# Altium schematic sheet Display.SchDoc
size A3
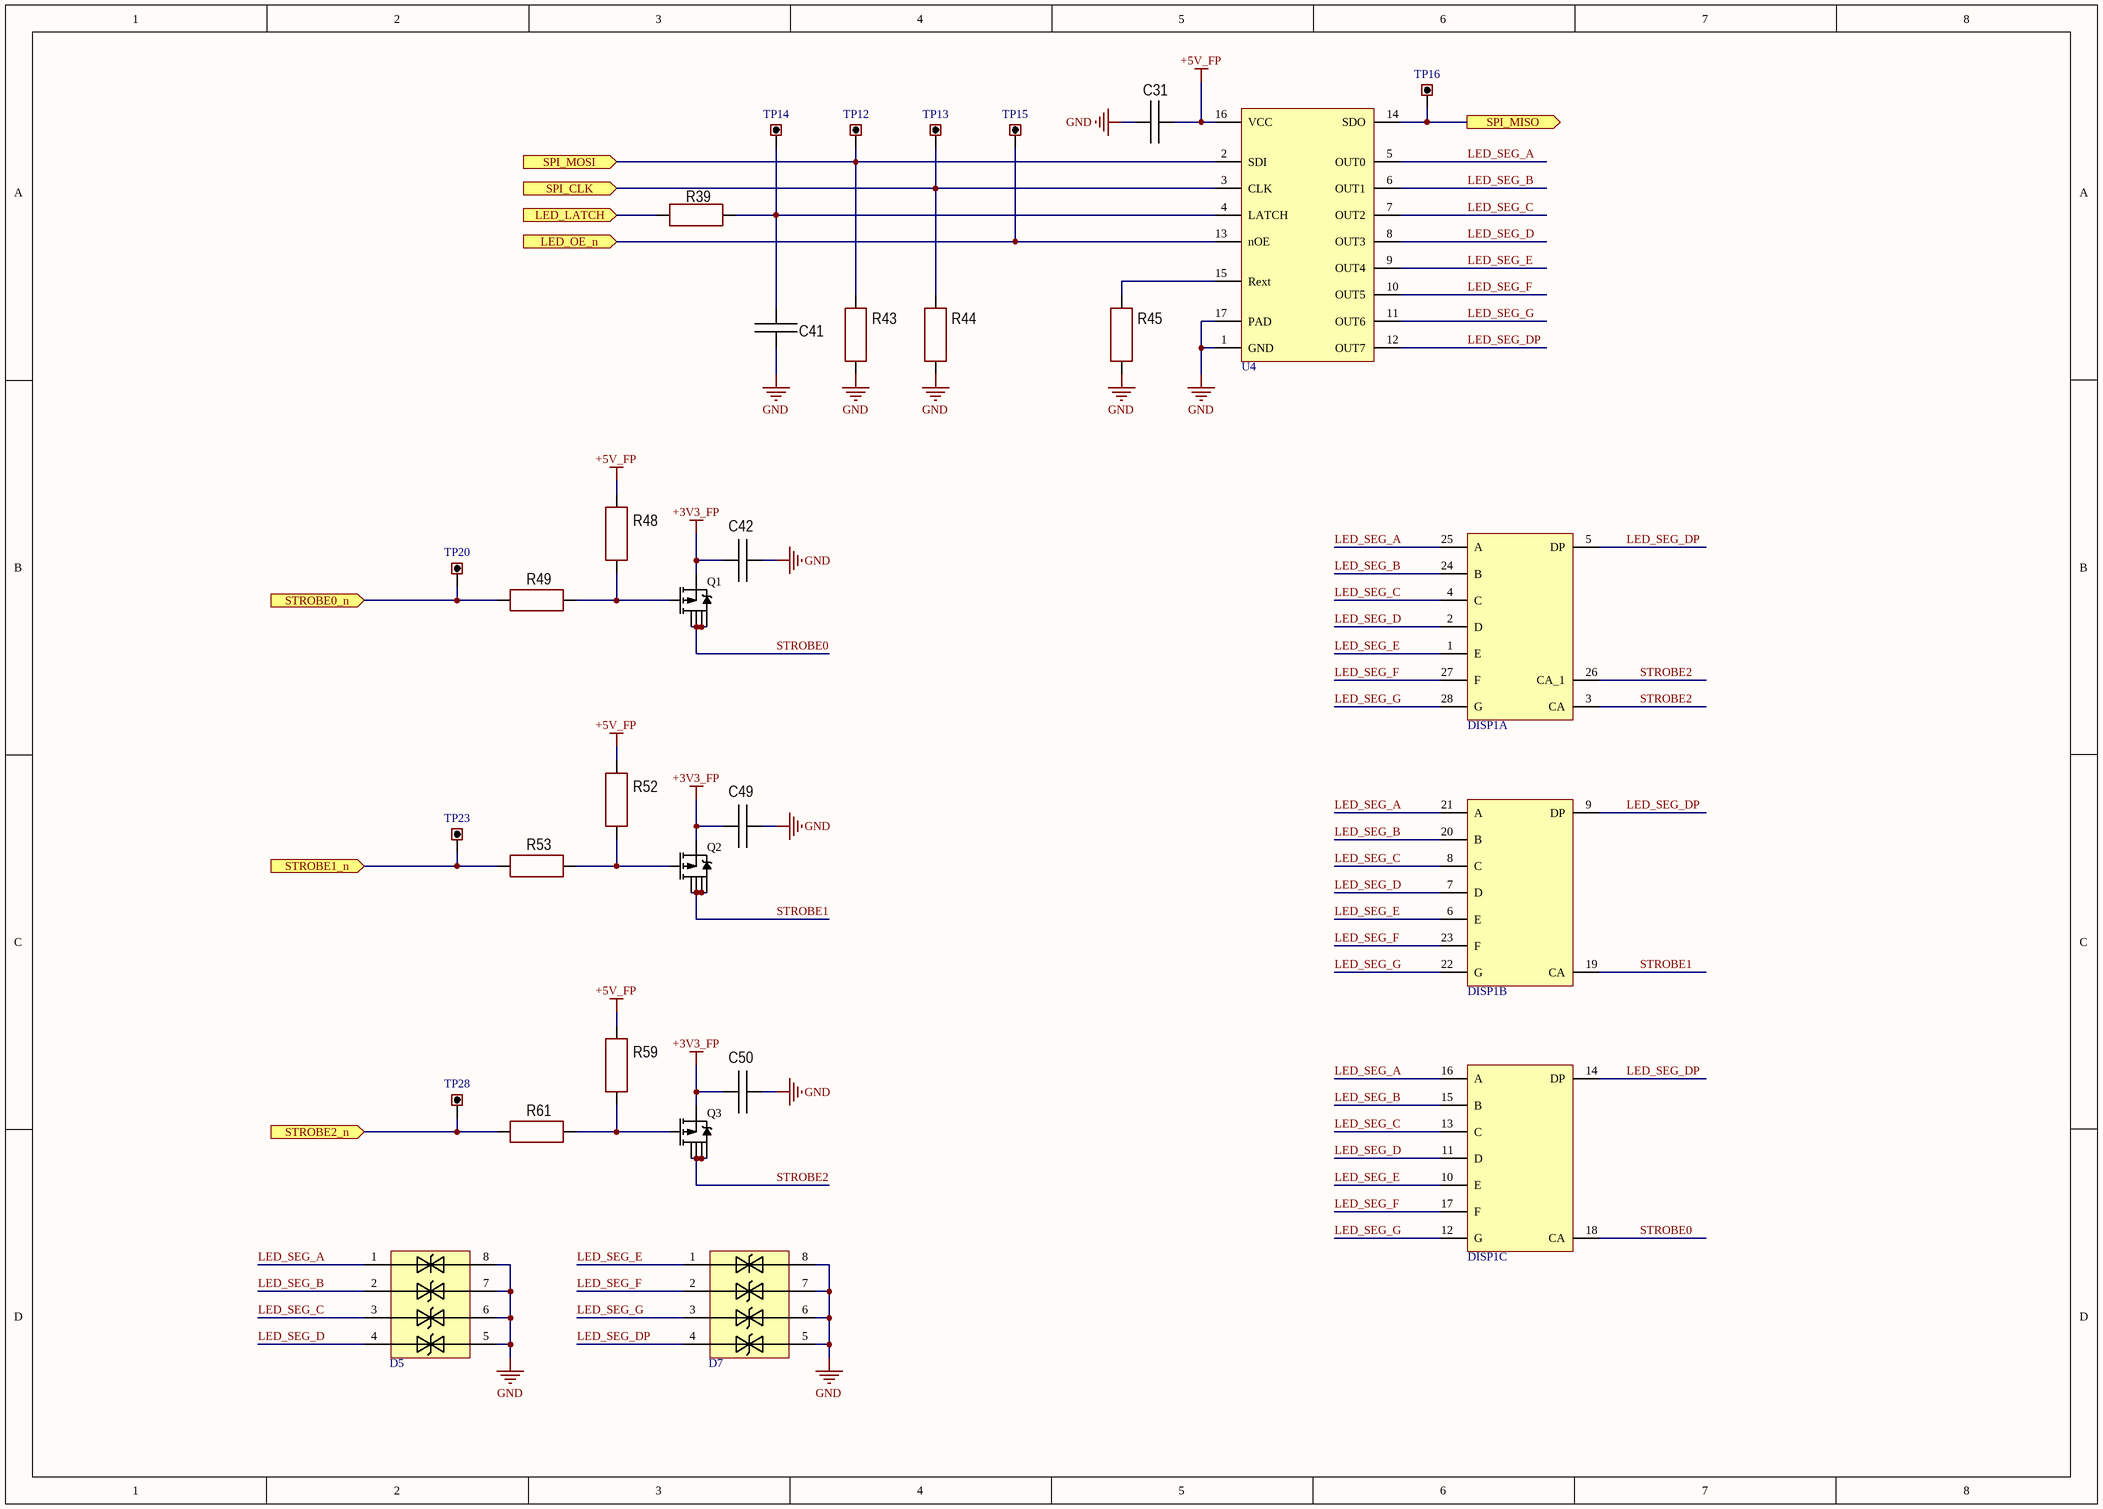
[diagram p0: Display.SchDoc]

## Parts
C31  (no value)  [CAP: 1206]
C41  (no value)  [CAP: 1206]
C42  (no value)  [CAP: 1206]
C49  (no value)  [CAP: 1206]
C50  (no value)  [CAP: 1206]
D5  (no value)  [8-SOIC]
D7  (no value)  [8-SOIC]
DISP1  (no value)  [BC56-11SRWA]  (parts A,B,C of 3)
Q1  (no value)  [SOT23-6]
Q2  (no value)  [SOT23-6]
Q3  (no value)  [SOT23-6]
R39  (no value)  [RES: 1206]
R43  (no value)  [RES: 1206]
R44  (no value)  [RES: 1206]
R45  (no value)  [RES: 1206]
R48  (no value)  [RES: 1206]
R49  (no value)  [RES: 1206]
R52  (no value)  [RES: 1206]
R53  (no value)  [RES: 1206]
R59  (no value)  [RES: 1206]
R61  (no value)  [RES: 1206]
TP12  Test_Point  [Test_Point]  (value not drawn)  (no BOM)
TP13  Test_Point  [Test_Point]  (value not drawn)  (no BOM)
TP14  Test_Point  [Test_Point]  (value not drawn)  (no BOM)
TP15  Test_Point  [Test_Point]  (value not drawn)  (no BOM)
TP16  Test_Point  [Test_Point]  (value not drawn)  (no BOM)
TP20  Test_Point  [Test_Point]  (value not drawn)  (no BOM)
TP23  Test_Point  [Test_Point]  (value not drawn)  (no BOM)
TP28  Test_Point  [Test_Point]  (value not drawn)  (no BOM)
U4  (no value)  [STP08DP05]

## Ports
LED_LATCH (in), LED_OE_n (in), SPI_CLK (in), SPI_MISO (out), SPI_MOSI (in), STROBE0_n (in), STROBE1_n (in), STROBE2_n (in)

## Nets
+3V3_FP: C42.1 C49.1 C50.1 Q1.4(S) Q2.4(S) Q3.4(S)
+5V_FP: C31.2 R48.2 R52.2 R59.2 U4.16(VCC)
GND: C31.1 C41.1 C42.2 C49.2 C50.2 D5.5 D5.6 D5.7 D5.8 D7.5 D7.6 D7.7 D7.8 R43.2 R44.2 R45.2 U4.1(GND) U4.17(PAD)
LED_LATCH: R39.1 ; port LED_LATCH
LED_OE_n: TP15.1 U4.13(nOE) ; port LED_OE_n
LED_SEG_A: D5.1 DISP1.16(A) DISP1.21(A) DISP1.25(A) U4.5(OUT0)
LED_SEG_B: D5.2 DISP1.15(B) DISP1.20(B) DISP1.24(B) U4.6(OUT1)
LED_SEG_C: D5.3 DISP1.4(C) DISP1.8(C) DISP1.13(C) U4.7(OUT2)
LED_SEG_D: D5.4 DISP1.2(D) DISP1.7(D) DISP1.11(D) U4.8(OUT3)
LED_SEG_DP: D7.4 DISP1.5(DP) DISP1.9(DP) DISP1.14(DP) U4.12(OUT7)
LED_SEG_E: D7.1 DISP1.1(E) DISP1.6(E) DISP1.10(E) U4.9(OUT4)
LED_SEG_F: D7.2 DISP1.17(F) DISP1.23(F) DISP1.27(F) U4.10(OUT5)
LED_SEG_G: D7.3 DISP1.12(G) DISP1.22(G) DISP1.28(G) U4.11(OUT6)
SPI_CLK: R44.1 TP13.1 U4.3(CLK) ; port SPI_CLK
SPI_MISO: TP16.1 U4.14(SDO) ; port SPI_MISO
SPI_MOSI: R43.1 TP12.1 U4.2(SDI) ; port SPI_MOSI
STROBE0: DISP1.18(CA) Q1.1(D) Q1.2(D) Q1.5(D) Q1.6(D)
STROBE0_n: R49.1 TP20.1 ; port STROBE0_n
STROBE1: DISP1.19(CA) Q2.1(D) Q2.2(D) Q2.5(D) Q2.6(D)
STROBE1_n: R53.1 TP23.1 ; port STROBE1_n
STROBE2: DISP1.3(CA) DISP1.26(CA_1) Q3.1(D) Q3.2(D) Q3.5(D) Q3.6(D)
STROBE2_n: R61.1 TP28.1 ; port STROBE2_n
NetC41_2: C41.2 R39.2 TP14.1 U4.4(LATCH)
NetQ1_3: Q1.3(G) R48.1 R49.2
NetQ2_3: Q2.3(G) R52.1 R53.2
NetQ3_3: Q3.3(G) R59.1 R61.2
NetR45_1: R45.1 U4.15(Rext)

## Library data of the parts
C31 C42 C49 C50 = Ceramic_1206: Manufacturer: Yageo; PartNumber: CC1206KRX7R9BB104; ValueManufacturerPartNumber: Ceramic capacitor, 0.1μF, 1206; TypeCapacitor: Ceramic capacitor; Tolerance: ±10%; TypeDielectric: X7R; Voltage: 50V; Value: 0.1μF; Package: 1206; HelpURL: https://www.digikey.com/product-detail/en/yageo/CC1206KRX7R9BB104/311-1179-1-ND/303089; Temperature: -55...+125°C
C41 = Ceramic_1206: Manufacturer: Yageo; PartNumber: CC1206KRX7R9BB104; ValueManufacturerPartNumber: Ceramic capacitor, 10nF, 1206; TypeCapacitor: Ceramic capacitor; Tolerance: ±10%; TypeDielectric: X7R; Voltage: 50V; Value: 10nF; Package: 1206; HelpURL: https://www.digikey.com/product-detail/en/yageo/CC1206KRX7R9BB104/311-1179-1-ND/303089; Temperature: -55...+125°C
D5 D7 = CDNBS08-T05C: ValueManufacturerPartNumber: CDNBS08-T05C, SOIC-8; Package: SOIC-8; PartNumber: CDNBS08-T05C
DISP1 = BC56-11SRWA: ValueManufacturerPartNumber: LED display, BA56-11SRWA; PartNumber: BA56-11SRWA
Q1-Q3 = DMP2067LVT: ValueManufacturerPartNumber: DMP2067LVT, SOT23-6; Package: SOT23-6; PartNumber: DMP2067LVT
R39 = Resistor_1206: Manufacturer: Yageo; PartNumber: RC1206JR-07100RL; ValueManufacturerPartNumber: Resistor, 47R, 1206; Power: 0.25W; Tolerance: ±5%; Value: 47R; Package: 1206; HelpURL: https://www.digikey.com/product-detail/en/yageo/RC1206JR-07100RL/311-100ERCT-ND/732153; Temperature: -55...+125°C; TypeResistor: Resistor
R43 R44 = Resistor_1206: Manufacturer: Yageo; PartNumber: RC1206JR-07100RL; ValueManufacturerPartNumber: Resistor, 10K, 1206; Power: 0.25W; Tolerance: ±5%; Value: 10K; Package: 1206; HelpURL: https://www.digikey.com/product-detail/en/yageo/RC1206JR-07100RL/311-100ERCT-ND/732153; Temperature: -55...+125°C; TypeResistor: Resistor
R45 R48 R52 R59 = Resistor_1206: Manufacturer: Yageo; PartNumber: RC1206JR-07100RL; ValueManufacturerPartNumber: Resistor, 1K, 1206; Power: 0.25W; Tolerance: ±5%; Value: 1K; Package: 1206; HelpURL: https://www.digikey.com/product-detail/en/yageo/RC1206JR-07100RL/311-100ERCT-ND/732153; Temperature: -55...+125°C; TypeResistor: Resistor
R49 R53 R61 = Resistor_1206: Manufacturer: Yageo; PartNumber: RC1206JR-07100RL; ValueManufacturerPartNumber: Resistor, 22.1R, 1206; Power: 0.25W; Tolerance: ±5%; Value: 22.1R; Package: 1206; HelpURL: https://www.digikey.com/product-detail/en/yageo/RC1206JR-07100RL/311-100ERCT-ND/732153; Temperature: -55...+125°C; TypeResistor: Resistor
U4 = STP08DP05: ValueManufacturerPartNumber: STP08DP05, TSOP-16; Package: TSOP-16; PartNumber: STP08DP05